# Altium schematic sheet WIZ500SR_RP_EVB.SchDoc
size A4; SheetNumber: 1; SheetTotal: 1
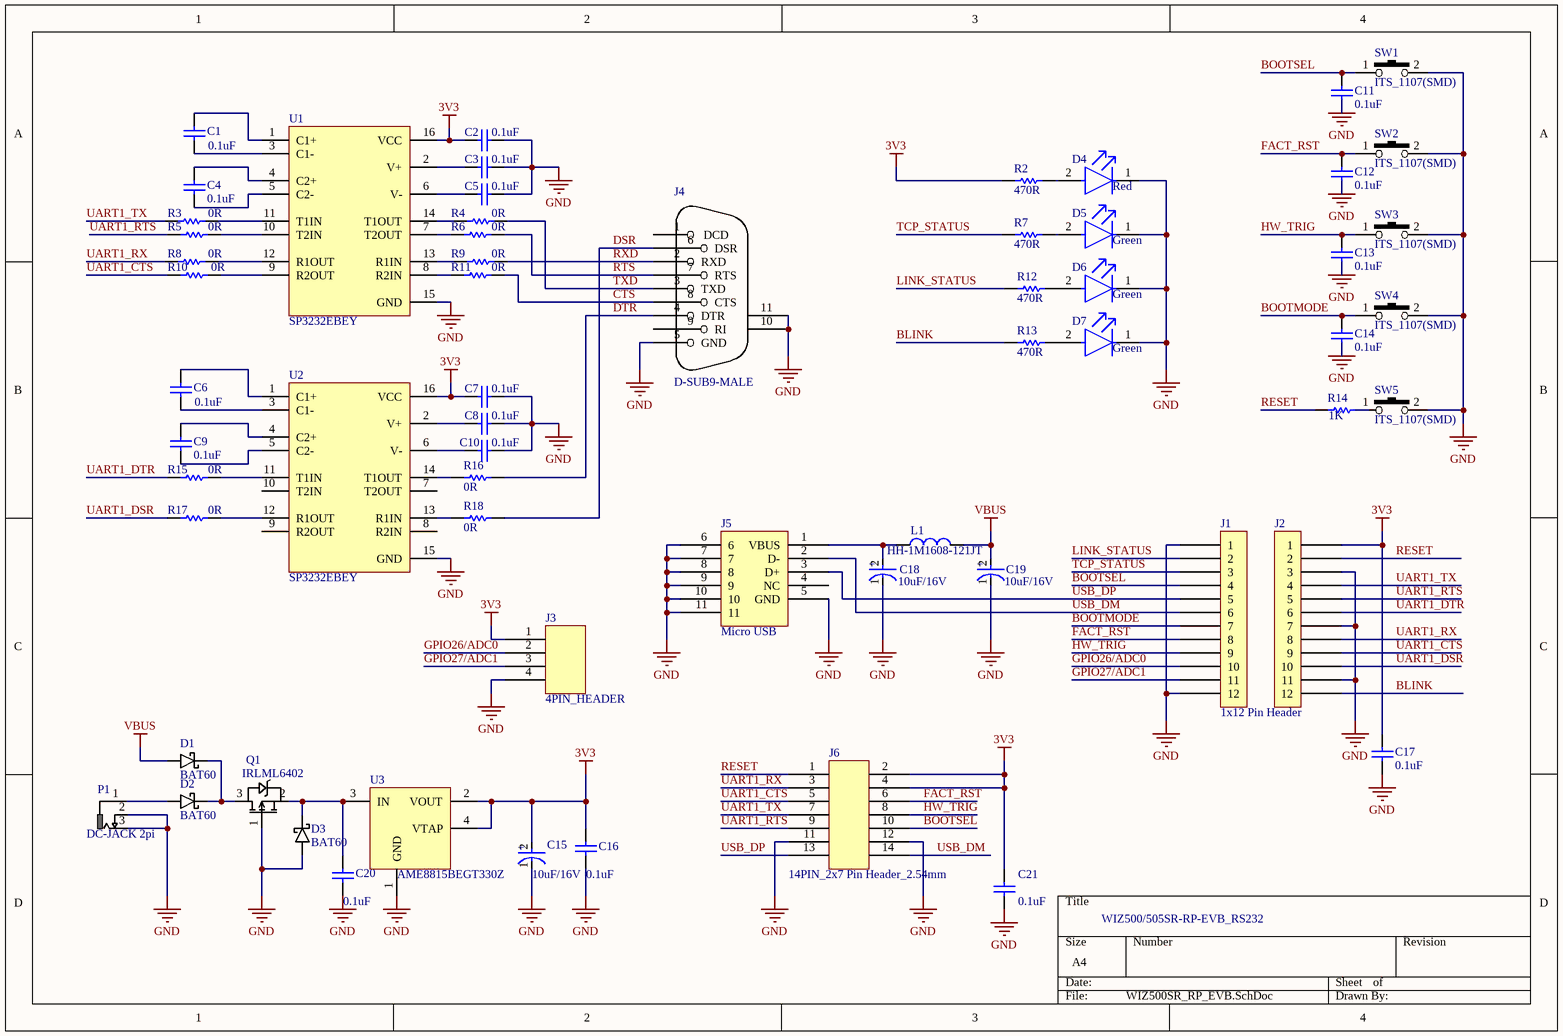
[diagram p0: WIZ500SR_RP_EVB.SchDoc]

## Parts
C1  0.1uF  [CAPC1005X55X25ML5T10]
C2  0.1uF  [CAPC1005X55X25ML5T10]
C3  0.1uF  [CAPC1005X55X25ML5T10]
C4  0.1uF  [CAPC1005X55X25ML5T10]
C5  0.1uF  [CAPC1005X55X25ML5T10]
C6  0.1uF  [CAPC1005X55X25ML5T10]
C7  0.1uF  [CAPC1005X55X25ML5T10]
C8  0.1uF  [CAPC1005X55X25ML5T10]
C9  0.1uF  [CAPC1005X55X25ML5T10]
C10  0.1uF  [CAPC1005X55X25ML5T10]
C11  0.1uF  [CAPC1005X55X25ML5T10]
C12  0.1uF  [CAPC1005X55X25ML5T10]
C13  0.1uF  [CAPC1005X55X25ML5T10]
C14  0.1uF  [CAPC1005X55X25ML5T10]
C15  10uF/16V  [FP-T520A107M006ATE045-MFG]
C16  0.1uF  [CAPC1005X55X25ML5T10]
C17  0.1uF  [CAPC1005X55X25ML5T10]
C18  10uF/16V  [FP-T520A107M006ATE045-MFG]
C19  10uF/16V  [FP-T520A107M006ATE045-MFG]
C20  0.1uF  [CAPC1005X55X25ML5T10]
C21  0.1uF  [CAPC1005X55X25ML5T10]
D1  BAT60  [BAT60A]
D2  BAT60  [BAT60A]
D3  BAT60  [BAT60A]
D4  Red  [FP-LTST-C191TBKT-MFG]
D5  Green  [FP-LTST-C191TBKT-MFG]
D6  Green  [FP-LTST-C191TBKT-MFG]
D7  Green  [FP-LTST-C191TBKT-MFG]
J1  1x12 Pin Header  [12PIN_HEADER_2mm]
J2  1x12 Pin Header  [12PIN_HEADER_2mm]  (value not drawn)
J3  4PIN_HEADER  [4PIN_HEADER]
J4  D-SUB9-MALE  [D-SUB9-MALE]
J5  Micro USB  [USB-MICRO-B(SMD)]
J6  14PIN_2x7 Pin Header_2.54mm  [14PIN_HEADER_2x7]
L1  HH-1M1608-121JT  [HH-1M11608-121JT]
P1  DC-JACK 2pi  [DC-JACK 2PI]
Q1  IRLML6402  [IRLML6402]
R2  470R  [RESC1005X40X25NL05T10]
R3  0R  [RESC1005X40X25NL05T10]
R4  0R  [RESC1005X40X25NL05T10]
R5  0R  [RESC1005X40X25NL05T10]
R6  0R  [RESC1005X40X25NL05T10]
R7  470R  [RESC1005X40X25NL05T10]
R8  0R  [RESC1005X40X25NL05T10]
R9  0R  [RESC1005X40X25NL05T10]
R10  0R  [RESC1005X40X25NL05T10]
R11  0R  [RESC1005X40X25NL05T10]
R12  470R  [RESC1005X40X25NL05T10]
R13  470R  [RESC1005X40X25NL05T10]
R14  1K  [RESC1005X40X25NL05T10]
R15  0R  [RESC1005X40X25NL05T10]
R16  0R  [RESC1005X40X25NL05T10]
R17  0R  [RESC1005X40X25NL05T10]
R18  0R  [RESC1005X40X25NL05T10]
SW1  ITS_1107(SMD)  [IT-1107(SMD)]
SW2  ITS_1107(SMD)  [IT-1107(SMD)]
SW3  ITS_1107(SMD)  [IT-1107(SMD)]
SW4  ITS_1107(SMD)  [IT-1107(SMD)]
SW5  ITS_1107(SMD)  [IT-1107(SMD)]
U1  SP3232EBEY  [SP3232EBEY-TSSOP16]
U2  SP3232EBEY  [SP3232EBEY-TSSOP16]
U3  AME8815BEGT330Z  [AME8815BEGT330Z]

## Nets
3V3: C2.1 C7.1 C15.2(A) C16.2 C17.2 C21.2 J2.1 J3.1 J6.2 J6.4 R2.1 U1.16(VCC) U2.16(VCC) U3.2(VOUT) U3.4(VTAP)
GND: C2.2 C3.2 C5.2 C7.2 C8.2 C10.2 C11.1 C12.1 C13.1 C14.1 C15.1(C) C16.1 C17.1 C18.1(C) C19.1(C) C20.1 C21.1 D3.2 D4.1(C) D5.1(C) D6.1(C) D7.1(C) J1.1 J1.12 J2.3 J2.7 J2.11 J3.4 J4.5(GND) J4.10 J4.11 J5.5(GND) J5.6 J5.7 J5.8 J5.9 J5.10 J5.11 J6.11 J6.12 P1.2 P1.3 Q1.1 SW1.2 SW2.2 SW3.2 SW4.2 SW5.2 U1.15(GND) U2.15(GND) U3.1(GND)
VBUS: C19.2(A) D1.2 L1.2
BLINK: J2.12 R13.1
BOOTMODE: C14.2 J1.7 SW4.1
BOOTSEL: C11.2 J1.4 J6.10 SW1.1
CTS: J4.8(CTS) R11.2
DSR: J4.6(DSR) R18.2
DTR: J4.4(DTR) R16.2
FACT_RST: C12.2 J1.8 J6.6 SW2.1
GPIO26/ADC0: J1.10 J3.2
GPIO27/ADC1: J1.11 J3.3
HW_TRIG: C13.2 J1.9 J6.8 SW3.1
LINK_STATUS: J1.2 R12.1
RESET: J2.2 J6.1 R14.1
RTS: J4.7(RTS) R6.2
RXD: J4.2(RXD) R9.2
TCP_STATUS: J1.3 R7.1
TXD: J4.3(TXD) R4.2
UART1_CTS: J2.9 J6.5 R10.1
UART1_DSR: J2.10 R17.1
UART1_DTR: J2.6 R15.1
UART1_RTS: J2.5 J6.9 R5.1
UART1_RX: J2.8 J6.3 R8.1
UART1_TX: J2.4 J6.7 R3.1
USB_DM: J1.6 J5.2(D-) J6.14
USB_DP: J1.5 J5.3(D+) J6.13
NetC1_1: C1.1 U1.3(C1-)
NetC1_2: C1.2 U1.1(C1+)
NetC3_1: C3.1 U1.2(V+)
NetC4_1: C4.1 U1.5(C2-)
NetC4_2: C4.2 U1.4(C2+)
NetC5_1: C5.1 U1.6(V-)
NetC6_1: C6.1 U2.3(C1-)
NetC6_2: C6.2 U2.1(C1+)
NetC8_1: C8.1 U2.2(V+)
NetC9_1: C9.1 U2.5(C2-)
NetC9_2: C9.2 U2.4(C2+)
NetC10_1: C10.1 U2.6(V-)
NetC18_2: C18.2(A) J5.1(VBUS) L1.1
NetC20_2: C20.2 D3.1 Q1.2 U3.3(IN)
NetD1_1: D1.1 D2.1 Q1.3
NetD2_2: D2.2 P1.1
NetD4_2: D4.2(A) R2.2
NetD5_2: D5.2(A) R7.2
NetD6_2: D6.2(A) R12.2
NetD7_2: D7.2(A) R13.2
NetR3_2: R3.2 U1.11(T1IN)
NetR4_1: R4.1 U1.14(T1OUT)
NetR5_2: R5.2 U1.10(T2IN)
NetR6_1: R6.1 U1.7(T2OUT)
NetR8_2: R8.2 U1.12(R1OUT)
NetR9_1: R9.1 U1.13(R1IN)
NetR10_2: R10.2 U1.9(R2OUT)
NetR11_1: R11.1 U1.8(R2IN)
NetR14_2: R14.2 SW5.1
NetR15_2: R15.2 U2.11(T1IN)
NetR16_1: R16.1 U2.14(T1OUT)
NetR17_2: R17.2 U2.12(R1OUT)
NetR18_1: R18.1 U2.13(R1IN)

Not connected (* = marked no-connect by the designer): J4 1(DCD) 9(RI); J5 4(NC); U2 7(T2OUT) 8(R2IN) 9(R2OUT) 10(T2IN)

## Notes on the sheet
- WIZ500/505SR-RP-EVB_RS232
- (in symbol CMP-03017-000014-1) +

## Library data of the parts
C1-C14 C16 C17 C20 C21 = CMP-1662-00017-1: Chip Capacitor, 1 nF, +/- 10%, 50 V, -55 to 125 degC, 0402 (1005 Metric), RoHS, Tape and Reel; Case\/Package: 0402; Type (Capacitors): X7R; Voltage Rating (DC): 50 V; Capacitance: 1 nF; Width: 0.5 mm; Pins: 2; REACH SVHC: No SVHC; Length: 1 mm; Height: 0.5 mm; PackageDescription: 2-Pin Surface Mount Device, Body 1 x 0.5 mm; DatasheetVersion: 07/2016; Mount: Surface Mount; ComponentLink2Description: Datasheet; Tolerance: 10%; ComponentLink2URL: http://psearch.en.murata.com/capacitor/product/GRM155R71H102KA01%23.pdf; ComponentLink1URL: http://www.murata.com/; Case Code (Metric): 1005; Package Quantity: 10000; Min Operating Temperature: -55 degC; Max Operating Temperature: 125 degC; Voltage Rating: 50 V; ComponentLink1Description: Manufacturer URL; Packaging: Tape and Reel; Radiation Hardening: No; RoHSCompliant: true; PackageReference: 0402; Mounting Technology: Surface Mount; Case Code (Imperial): 0402
C15 C18 C19 = CMP-03017-000014-1: CAP TANT POLY 100UF 6.3V 1206; Tolerance: 20%; Life (Hours): 2000Hour; ESR (Equivalent Series Resistance): 45mR; Case Code (Metric): 3216; Features: General Purpose; Max Operating Temperature: 105°C; Case/Package: 1206; Case Code (Imperial): 1206; Min Operating Temperature: -55°C; Mount: Surface Mount; Voltage Rating: 6.3V; Packaging: Tape and Reel; Capacitance: 100uF; RoHS Compliant: Yes
D1-D3 = Schottky_Diode(BAT60)
D4-D7 = CMP-22017-000008-1: LED BLUE CLEAR CHIP SMD; Lens Color: Colorless; Dominant Wavelength: 475nm; Forward Current: 20mA; Wavelength: 468nm; Viewing Angle: 130°; Power Dissipation: 76mW; Luminous Intensity: 180mcd; Reverse Voltage: 5V; Number of Elements: 1; Lens Style: Diffused; Forward Voltage: 3.8V; Max Power Dissipation: 75mW; Case Code (Metric): 1608; Packaging: Tape and Reel; Case/Package: 0603; Depth: 1.6mm; Mount: Surface Mount; Lead Free: Lead Free; Min Operating Temperature: -20°C; Lens Transparency: Clear; Illumination Color: Blue; Height: 0.55mm; Test Current: 20mA; Case Code (Imperial): 0603; Max Operating Temperature: 80°C; Number of Pins: 2; Length: 0.8mm; Radiation Hardening: No; Package Quantity: 1; Number of LEDs: 1; Width: 0.8mm; Color: Blue
J1 J2 = 12PIN_2mm
J3 = 4PIN
J5 = Micro USB 5Pin
R2-R18 = CMP-1011-00001-2: Manufacturer: Yageo / Phycomp; Part Number: RC0402JR-070RL
SW1-SW5 = ITS_1107(SW)
U3 = AME8815BEGT330Z(3.3_LDO)